# Altium schematic sheet 24V_FETS.SchDoc: Title
size A4; Project: Q24 VCU; ENG_APP_DATE: --/--/--; DSN_APP_DATE: --/--/--; CHK_APP_DATE: --/--/--; Date: *******; ApprovedBy: *******; CheckedBy: None; Author: *******; CompanyName: *******; DrawnBy: Jacob Chisholm; Engineer: *******; Organization: *******; Address1: *******; Address2: *******; Address3: *******; Address4: *******; DocumentNumber: 6; Revision: *******; SheetNumber: 6; SheetTotal: 14; Address_Website: https://jchisholm204.github.io; E-Mail: JacobChisholm1010@gmail.com; CurrentTime: *******; CurrentDate: *******; Time: *******; DocumentFullPathAndName: *******; DocumentName: *******; ModifiedDate: *******; ImagePath: *******; ProjectName: *******; Application_BuildNumber: *******
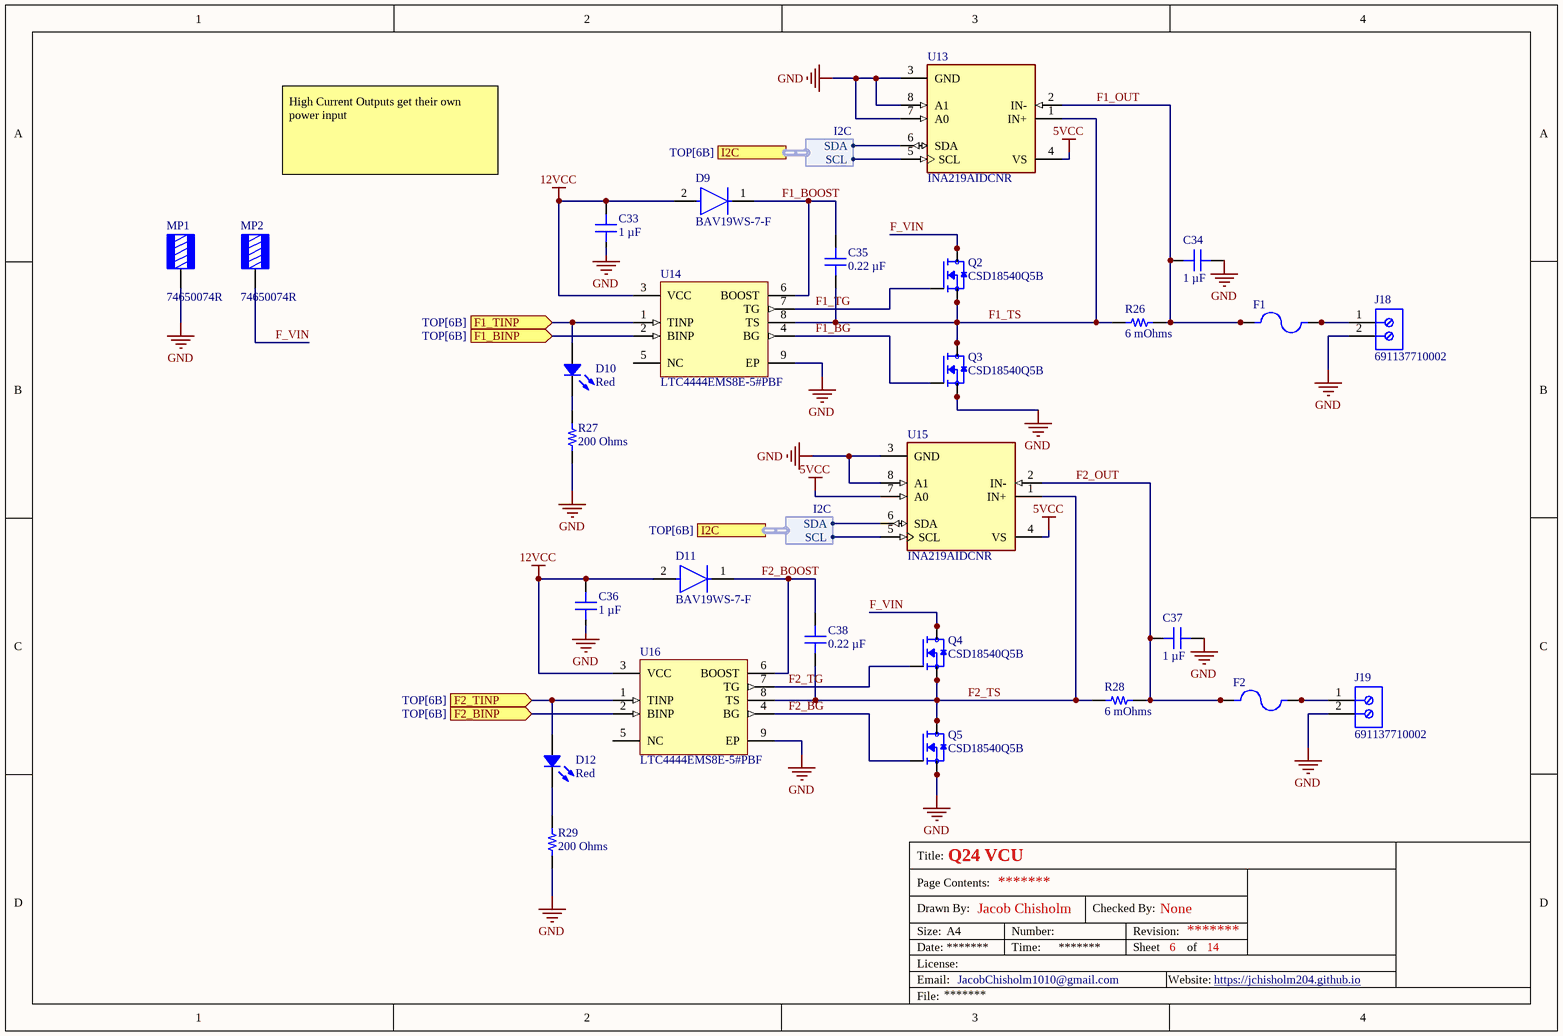
[diagram p0: 24V_FETS.SchDoc]

## Parts
C33  1 µF  [CAP 0603_1608]
C34  1 µF  [CAP 0805_2012]
C35  0.22 µF  [CAP 0603_1608]
C36  1 µF  [CAP 0603_1608]
C37  1 µF  [CAP 0805_2012]
C38  0.22 µF  [CAP 0603_1608]
D9  BAV19WS-7-F  [FP-SOD323-MFG]
D10  Red  [LED 0603_1608 RED]
D11  BAV19WS-7-F  [FP-SOD323-MFG]
D12  Red  [LED 0603_1608 RED]
F1  (no value)  [FUSE_3587-10TR]
F2  (no value)  [FUSE_3587-10TR]
J18  691137710002  [691137710002]
J19  691137710002  [691137710002]
MP1  74650074R  [WURTH 74650074]
MP2  74650074R  [WURTH 74650074]
Q2  CSD18540Q5B  [TRANS_CSD18540Q5B]
Q3  CSD18540Q5B  [TRANS_CSD18540Q5B]
Q4  CSD18540Q5B  [TRANS_CSD18540Q5B]
Q5  CSD18540Q5B  [TRANS_CSD18540Q5B]
R26  6 mOhms  [RES 0805_2012]
R27  200 Ohms  [RES 0603_1608]
R28  6 mOhms  [RES 0805_2012]
R29  200 Ohms  [RES 0603_1608]
U13  INA219AIDCNR  [FP-DCN0008A-IPC_B]
U14  LTC4444EMS8E-5#PBF  [LT-MS8E-8-EDP_L]
U15  INA219AIDCNR  [FP-DCN0008A-IPC_B]
U16  LTC4444EMS8E-5#PBF  [LT-MS8E-8-EDP_L]

## Ports
F1_BINP (in, see TOP[6B]), F1_TINP (in, see TOP[6B]), F2_BINP (in, see TOP[6B]), F2_TINP (in, see TOP[6B]), I2C (harness I2C, see TOP[6B])

## Harnesses
I2C: SDA, SCL

## Nets
5VCC: U13.4(VS) U15.4(VS) U15.7(A0)
12VCC: C33.2 C36.2 D9.2(A) D11.2(A) U14.3(VCC) U16.3(VCC)
GND: C33.1 C34.1 C36.1 C37.1 J18.2 J19.2 MP1.1 Q3.1(S) Q3.2(S) Q3.3(S) Q5.1(S) Q5.2(S) Q5.3(S) R27.2 R29.2 U13.3(GND) U13.7(A0) U13.8(A1) U14.9(EP) U15.3(GND) U15.8(A1) U16.9(EP)
F1_BG: Q3.4(G) U14.4(BG)
F1_BINP: U14.2(BINP) ; port F1_BINP
F1_BOOST: C35.2 D9.1(C) U14.6(BOOST)
F1_OUT: C34.2 F1.1_1 F1.1_2 R26.2 U13.2(IN-)
F1_TG: Q2.4(G) U14.7(TG)
F1_TINP: D10.1 U14.1(TINP) ; port F1_TINP
F1_TS: C35.1 Q2.1(S) Q2.2(S) Q2.3(S) Q3.5(D) Q3.6(D) Q3.7(D) Q3.8(D) R26.1 U13.1(IN+) U14.8(TS)
F2_BG: Q5.4(G) U16.4(BG)
F2_BINP: U16.2(BINP) ; port F2_BINP
F2_BOOST: C38.2 D11.1(C) U16.6(BOOST)
F2_OUT: C37.2 F2.1_1 F2.1_2 R28.2 U15.2(IN-)
F2_TG: Q4.4(G) U16.7(TG)
F2_TINP: D12.1 U16.1(TINP) ; port F2_TINP
F2_TS: C38.1 Q4.1(S) Q4.2(S) Q4.3(S) Q5.5(D) Q5.6(D) Q5.7(D) Q5.8(D) R28.1 U15.1(IN+) U16.8(TS)
F_VIN: MP2.1 Q2.5(D) Q2.6(D) Q2.7(D) Q2.8(D) Q4.5(D) Q4.6(D) Q4.7(D) Q4.8(D)
NetD10_2: D10.2 R27.1
NetD12_2: D12.2 R29.1
NetF1_2_1: F1.2_1 F1.2_2 J18.1
NetF2_2_1: F2.2_1 F2.2_2 J19.1
NetU13_5: U13.5(SCL) U15.5(SCL) ; port I2C.SCL
NetU13_6: U13.6(SDA) U15.6(SDA) ; port I2C.SDA

Not connected (* = marked no-connect by the designer): U14 5(NC); U16 5(NC)

## Notes on the sheet
- High Current Outputs get their own power input
- Title:
- Drawn By:
- Page Contents:
- Checked By:
- Size:
- Date:
- File:
- License:
- Email:
- A4
- Number:
- Time:
- Revision:
- Sheet
- Website:
- of

## Library data of the parts
C33 C36 = 0603DC105KAT2A: CAP CER 1UF 35V X7R 0603; manufacturer: KYOCERA AVX; Tolerance: ±10%; Part Number: 0603DC105KAT2A; Value: 1 µF; Applications: General Purpose; Capacitance: 1 µF; componentlink1description: Datasheet; componentlink1url: https://media.digikey.com/pdf/Data%20Sheets/AVX%20PDFs/0603DC105KAT2A_DS.pdf; componentlink2description: DigiKey Link; componentlink2url: https://www.digikey.com/en/products/detail/kyocera-avx/0603DC105KAT2A/11208437; Device Package: 0603 (1608 Metric); lastupdated: 2/9/2024 8:09:59 PM; Lifecycle Status: Active; Minimum Order: 1; Mounting Type: Surface Mount, MLCC; Operating Temperature: -55°C ~ 125°C; Package / Case: 0603 (1608 Metric); packaging: TapeAndReel; partid: 35801; Part Status: Active; price: 0.04; series: -; Size / Dimension: 0.063" L x 0.032" W (1.60mm x 0.81mm); Supplier 1: DigiKey; Supplier Part Number 1: 478-0603DC105KAT2ACT-ND; Temperature Coefficient: X7R; Voltage - Rated: 35V
C34 C37 = GCJ21BR71H105KA01L: CAP CER 1UF 50V X7R 0805; manufacturer: Murata Electronics; Tolerance: ±10%; Part Number: GCJ21BR71H105KA01L; Value: 1 µF; Applications: Automotive, Boardflex Sensitive; Capacitance: 1 µF; componentlink1description: Datasheet; componentlink1url: https://www.murata.com/~/media/webrenewal/support/library/catalog/products/capacitor/mlcc/c03e.ashx?la=en-us; componentlink2description: DigiKey Link; componentlink2url: https://www.digikey.com/en/products/detail/murata-electronics/GCJ21BR71H105KA01L/4903512; Device Package: 0805 (2012 Metric); Features: Soft Termination; lastupdated: 12/20/2023 8:14:07 PM; Lifecycle Status: Active; Minimum Order: 1; Mounting Type: Surface Mount, MLCC; Operating Temperature: -55°C ~ 125°C; Package / Case: 0805 (2012 Metric); packaging: TapeAndReel; partid: 2709; Part Status: Active; price: 0.05; Ratings: AEC-Q200; series: GCJ; Size / Dimension: 0.079" L x 0.049" W (2.00mm x 1.25mm); Supplier 1: DigiKey; Supplier Part Number 1: 490-10667-1-ND; Temperature Coefficient: X7R; Thickness (Max): 0.057" (1.45mm); Voltage - Rated: 50V
C35 C38 = 0603B224K160CT: CAP CER 0.22UF 16V X7R 0603; manufacturer: Walsin Technology Corporation; Tolerance: ±10%; Part Number: 0603B224K160CT; Value: 0.22 µF; Applications: General Purpose; Capacitance: 0.22 µF; componentlink1description: Datasheet; componentlink1url: http://www.passivecomponent.com/wp-content/uploads/2018/10/MLCC.pdf; componentlink2description: DigiKey Link; componentlink2url: https://www.digikey.com/en/products/detail/walsin-technology-corporation/0603B224K160CT/9354916; Device Package: 0603 (1608 Metric); lastupdated: 2/9/2024 8:10:20 PM; Lifecycle Status: Active; Minimum Order: 1; Mounting Type: Surface Mount, MLCC; Operating Temperature: -55°C ~ 125°C; Package / Case: 0603 (1608 Metric); packaging: TapeAndReel; partid: 9838; Part Status: Active; price: 0.01; series: -; Size / Dimension: 0.063" L x 0.031" W (1.60mm x 0.80mm); Supplier 1: DigiKey; Supplier Part Number 1: 1292-1419-1-ND; Temperature Coefficient: X7R; Thickness (Max): 0.034" (0.87mm); Voltage - Rated: 16V
D9 D11 = CMP-12791-000007-1: DIODE GEN PURP 100V 200MA SOD323; Manufacturer: Diodes Inc.; Max Surge Forward Current: 1.7A; Max Repetitive Reverse Voltage: 120V; Value: 5pF; Forward Current: 250mA; Standoff Height: 0.05mm; Automotive Grade: Grade 0; Max Junction Temp: +150°C; Peak Reverse Current: 0.1uA; Temperature Range Low: -65°C; ComponentLink2Description: Datasheet; Temperature Range High: +150°C; Device Class L1: Discrete Semiconductors; Octopart: https://octopart.com/bav19ws-7-f-diodes+inc.-55426588; ComponentLink2URL: https://www.diodes.com/assets/Datasheets/ds30119.pdf; Temperature: -65°C to +150°C; Reverse Voltage: 100V; Capacitance: 5pF; Automotive: Yes; Footprint Url: https://www.diodes.com/assets/Package-Files/SOD323.pdf; Lead Free: Yes; Package: SOD323; Digikey Description: DIODE GEN PURP 100V 200MA SOD323; Mouser Description: Diodes - General Purpose, Power, Switching 100V 200mW; Height: 1.1mm; Device Class L2: Diodes; Manufacturer Part Number: BAV19WS-7-F; Category: Diode; RoHS: TRUE; Device Class L3: Rectifier Diodes
D10 D12 = 19-213SDRC/S259/TR8: LED RED CLEAR 2SMD; Manufacturer: Everlight Electronics Co Ltd; Configuration: Standard; Current - Test: 10mA; Lens Color: Colorless; Lens Size: 1.20mm x 0.80mm; Lens Style: Rectangle with Flat Top; Viewing Angle: 120°; Voltage - Forward (Vf) (Typ): 2V; Wavelength - Peak: 650nm; Part Number: 19-213SDRC/S259/TR8; Color: Red; ComponentLink1Description: Datasheet; ComponentLink1URL: //media.digikey.com/pdf/Data%20Sheets/Everlight%20PDFs/19-213SDRC-S259-TR8.pdf; ComponentLink2Description: DigiKey Link; ComponentLink2URL: http://digikey.com/product-detail/en/everlight-electronics-co-ltd/19-213SDRC-S259-TR8/1080-1580-1-ND/8535303; Device Package: 0603 (1608 Metric); Height (Max): 0.70mm; LastUpdated: 2/2/2024 9:29:56 PM; Lens Transparency: Clear; Lifecycle Status: Active; Minimum Order: 1; Mounting Type: Surface Mount; Package / Case: 0603 (1608 Metric); Packaging: TapeAndReel; PartId: 372; Part Status: Active; Price: 0.06; Series: -; Size / Dimension: 1.60mm L x 0.80mm W; Supplier 1: DigiKey; Supplier Part Number 1: 1080-1580-1-ND; Supplier Device Package: 2-SMD; Value: Red
F1 F2 = 3587-10TR: MP: 3587-10TR; Price: None; Value: *; Availability: Unavailable; Package: None
J18 J19 = CMP-1502-03324-2: NexarPartId: 78871135; Voltage Rating: 300V; Number of Contacts: 2; Current Rating: 16A; Lead Pitch: 5mm; Height: 11.6mm; Packaging: Box; RoHS: Non-Compliant; Contact Material: Nickel, Tin; Max Operating Temperature: 120°C; Number of Pins: 2; Min Operating Temperature: -30°C; Number of Rows: 1
MP1 MP2 = 74650074R: TERM REDCUBE M4 4PIN PCB; Manufacturer: Würth Elektronik; Current Rating (Amps): 50 A; Part Number: 74650074R; ComponentLink1Description: Datasheet; ComponentLink1URL: https://katalog.we-online.de/em/datasheet/74650074R.pdf; ComponentLink2Description: DigiKey Link; ComponentLink2URL: https://www.digikey.com/en/products/detail/würth-elektronik/74650074R/6643979; Features: Screw not Included; LastUpdated: 8/7/2022 8:40:07 PM; Lifecycle Status: Active; Minimum Order: 1; Mounting Type: Through Hole; Number of Pins: 4; Packaging: TapeAndReel; Part Status: Active; Price: 2.38; Screw Size: M4; Series: REDCUBE WP-THRBU; Supplier 1: DigiKey; Supplier Part Number 1: 732-10883-1-ND; Terminal Type: Screw Terminal, Power Tap; Termination: Solder
Q2-Q5 = CSD18540Q5B: 60-V, N channel NexFETâ„¢ power MOSFET, single SON 5 mm x 6 mm, 2.2 mOhm; MF: Texas Instruments; SnapEDA_Link: https://www.snapeda.com/parts/CSD18540Q5B/Texas+Instruments/view-part/?ref=snap; Purchase-URL: https://pricing.snapeda.com/search/part/CSD18540Q5B/?ref=eda; Package: VSON-CLIP-8 Texas Instruments; MP: CSD18540Q5B; Price: None; Availability: In Stock; Check_prices: https://www.snapeda.com/parts/CSD18540Q5B/Texas+Instruments/view-part/?ref=eda; Value: *
R26 R28 = TLR2ATTD6L00F: RES 0.006 OHM 1% 1W 0805; Manufacturer: KOA Speer Electronics, Inc.; Temperature Coefficient: ±100ppm/°C; Part Number: TLR2ATTD6L00F; Value: 6 mOhms; ComponentLink1Description: Datasheet; ComponentLink1URL: http://www.koaspeer.com/catimages/Products/TLR1E-2A/TLR1E-2A.pdf; ComponentLink2Description: DigiKey Link; ComponentLink2URL: https://www.digikey.com/en/products/detail/koa-speer-electronics-inc/TLR2ATTD6L00F/9845498; Composition: Metal Element; Device Package: 0805 (2012 Metric); Features: Automotive AEC-Q200, Current Sense; Height - Seated (Max): 0.018" (0.45mm); LastUpdated: 1/24/2024 8:59:35 PM; Lifecycle Status: Active; Minimum Order: 1; Number of Terminations: 2; Operating Temperature: -65°C ~ 155°C; Package / Case: 0805 (2012 Metric); Packaging: TapeAndReel; PartId: 42677; Part Status: Active; Power (Watts): 1W; Price: 0.21; Ratings: AEC-Q200; Resistance: 6 mOhms; Series: TLR; Size / Dimension: 0.079" L x 0.049" W (2.00mm x 1.25mm); Supplier 1: DigiKey; Supplier Part Number 1: 2019-TLR2ATTD6L00FCT-ND; Supplier Device Package: 0805; Tolerance: ±1%
R27 R29 = RS73F1JTTD2000B: RES 200 OHM 0.1% 1/5W 0603; Manufacturer: KOA Speer Electronics, Inc.; Power (Watts): 0.2W, 1/5W; Temperature Coefficient: ±25ppm/°C; Part Number: RS73F1JTTD2000B; Value: 200 Ohms; ComponentLink1Description: Datasheet; ComponentLink1URL: http://www.koaspeer.com/pdfs/RS73.pdf; ComponentLink2Description: DigiKey Link; ComponentLink2URL: https://www.digikey.com/en/products/detail/koa-speer-electronics-inc/RS73F1JTTD2000B/11594419; Composition: Thick Film; Device Package: 0603 (1608 Metric); Features: Automotive AEC-Q200, Moisture Resistant; Height - Seated (Max): 0.022" (0.55mm); LastUpdated: 2/2/2024 8:38:37 PM; Lifecycle Status: Active; Minimum Order: 1; Number of Terminations: 2; Operating Temperature: -55°C ~ 155°C; Package / Case: 0603 (1608 Metric); Packaging: TapeAndReel; PartId: 56369; Part Status: Active; Price: 0.07; Ratings: AEC-Q200; Resistance: 200 Ohms; Series: RS73; Size / Dimension: 0.063" L x 0.031" W (1.60mm x 0.80mm); Supplier 1: DigiKey; Supplier Part Number 1: 2019-RS73F1JTTD2000BCT-ND; Supplier Device Package: 0603; Tolerance: ±0.1%
U13 U15 = CMP-0704-00041-3: IC CURRENT MONITOR 1% SOT23-8; Common Mode Rejection Ratio: 100dB; Bandwidth: 3.4MHz; Operating Supply Current: 1mA; Nominal Supply Current: 700uA; Min Input Voltage: 0V; Output Current per Channel: 10mA; Number of Amplifiers: 1; Input Offset Voltage (Vos): 100uV; Max Input Voltage: 26V; Min Supply Voltage: 3V; Max Supply Current: 5mA; Max Supply Voltage: 5.5V; Output Type: Digital; Accuracy: 1%; Radiation Hardening: No; Min Operating Temperature: -40°C; Contact Plating: Gold; REACH SVHC: No SVHC; Packaging: Tape and Reel; Max Operating Temperature: 125°C; Lead Free: Lead Free; Weight: 0.001411oz; Supply Current: 700uA; Number of Pins: 8; Length: 3mm; Quiescent Current: 700uA; Features: I²C; Height: 1.3mm; Output Current: 10mA; Case/Package: SOT-23-8; RoHS Compliant: Yes; Width: 1.75mm; Package Quantity: 3000; Series: Zero-Drift
U14 U16 = CMP-0479-00254-1: High Voltage Synchronous N-Channel MOSFET Driver, 114 V Vin MAX, 8-pin SOP (MS8E-8-EDP), -40 to 125 degC, Pb-Free; Manufacturer: Linear Technology; PackageReference: MS8E-8; ComponentLink2Description: Datasheet; DatasheetVersion: Rev. C; ComponentLink3Description: Package Specification; PartNumber: LTC4444EMS8E-5#PBF; ComponentLink3URL: http://cds.linear.com/docs/en/packaging/05081662_K_MS8E.pdf; PackageVersion: Rev. J, 10/2011; ComponentLink1URL: http://www.linear.com/; ComponentLink1Description: Manufacturer URL; Mounting Technology: Surface Mount; ComponentLink2URL: http://cds.linear.com/docs/en/datasheet/44445fc.pdf; PackageDescription: 8-Pin Plastic MSOP, Body 3.00 x 3.00 mm. Pitch 0.65 mm; RoHS: TRUE